# Altium schematic sheet FLASH.SchDoc: XC7A3G-FLASH
size A4; Date: 9 AUG 2026; Engineer: Parsa Malekpour; Revision: 1.0.0; SheetNumber: 16; SheetTotal: 18
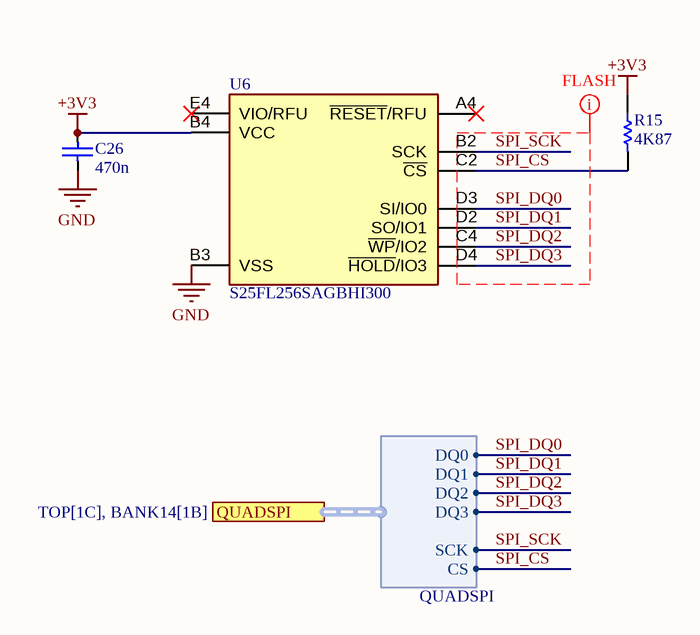
[diagram p0: FLASH.SchDoc]

## Parts
C26  value 470n  [FP-C1005-050-0_05-IPC_C]  (hidden comment: C1005X5R1E474K050BB)
R15  value 4K87  [RESC1005X40X25LL05T10]  (hidden comment: RC0402FR-074K87L)
U6  S25FL256SAGBHI300  [BGA24C100P4X6_600X800X120]

## Ports
QUADSPI (harness QUADSPI, see TOP[1C], BANK14[1B])

## Harnesses
QUADSPI: DQ0, DQ1, DQ2, DQ3, SCK, CS

## Nets
+3V3: C26.1 R15.1 U6.B4(VCC)
GND: C26.2 U6.B3(VSS)
SPI_CS: R15.2 U6.C2(~{CS}) ; port QUADSPI.CS
SPI_DQ0: U6.D3(SI/IO0) ; port QUADSPI.DQ0
SPI_DQ1: U6.D2(SO/IO1) ; port QUADSPI.DQ1
SPI_DQ2: U6.C4(~{WP}/IO2) ; port QUADSPI.DQ2
SPI_DQ3: U6.D4(~{HOLD}/IO3) ; port QUADSPI.DQ3
SPI_SCK: U6.B2(SCK) ; port QUADSPI.SCK

Not connected (* = marked no-connect by the designer): U6 A1(NC_1) A2(NC_2) A3(NC_3) A4(~{RESET}/RFU)* B1(DNU_1) C1(DNU_2) C3(RFU) D1(DNU_3) E1(NC_4) E2(NC_5) E3(NC_6) E4(VIO/RFU)* F1(NC_7) F2(NC_8) F3(NC_9) F4(NC_10)

## Layout directives
net class FLASH; rule Matched Net Lengths [Delay Tolerance = 100ps]: SPI_CS, SPI_DQ0, SPI_DQ1, SPI_DQ2, SPI_DQ3, SPI_SCK

## Notes on the sheet
- TITLE
- REV
- Date
- A4
- FILE NAME
- CODE
- SHEET
- Engineer
- OF

## Library data of the parts
C26 = C1005X5R1E474K050BB: MLCC 470nF ±10% 25V X5R SMD 0402; Dielectric Material: Ceramic; Dissipation Factor: 10%; Case Code (Metric): 1005; RoHS Compliant: Yes; Lead Free: Lead Free; Length: 1mm; Case/Package: 0402; Termination: SMD/SMT; Dielectric: X5R; Depth: 0.5mm; Series: C; Voltage: 25V; Tolerance: 10%; Packaging: Tape and Reel; Resistor Type: Ceramic; Min Operating Temperature: -55°C; Width: 0.02inch; Thickness: 500um; Package Quantity: 10000; Case Code (Imperial): 0402; Construction: Flat; Height: 0.5mm; REACH SVHC: No SVHC; Radiation Hardening: No; Weight: 2.3E-05oz; Mount: Surface Mount; Voltage Rating (DC): 25V; Max Operating Temperature: 85°C; Part Number: C1005X5R1E474K050BB; Voltage Rating: 25V
R15 = RC0402FR-074K87L: Manufacturer: Yageo / Phycomp; Part Number: RC0402FR-074K87L
U6 = S25FL256SAGBHI200: Integrated Circuit; Manufacturer_Name: Infineon; Datasheet Link: https://www.cypress.com/file/448601/download; Height: 1.2mm; Manufacturer_Part_Number: S25FL256SAGBHI300; Mouser Part Number: 797-25FL256SAGBHI300; Mouser Price/Stock: https://www.mouser.co.uk/ProductDetail/Infineon-Technologies/S25FL256SAGBHI200?qs=%252B97ACBfLqz%2F7D9cRggMsKA%3D%3D; Arrow Part Number: S25FL256SAGBHI300; Arrow Price/Stock: https://www.arrow.com/en/products/s25fl256sagbhi200/infineon-technologies-ag?utm_currency=USD&region=nac